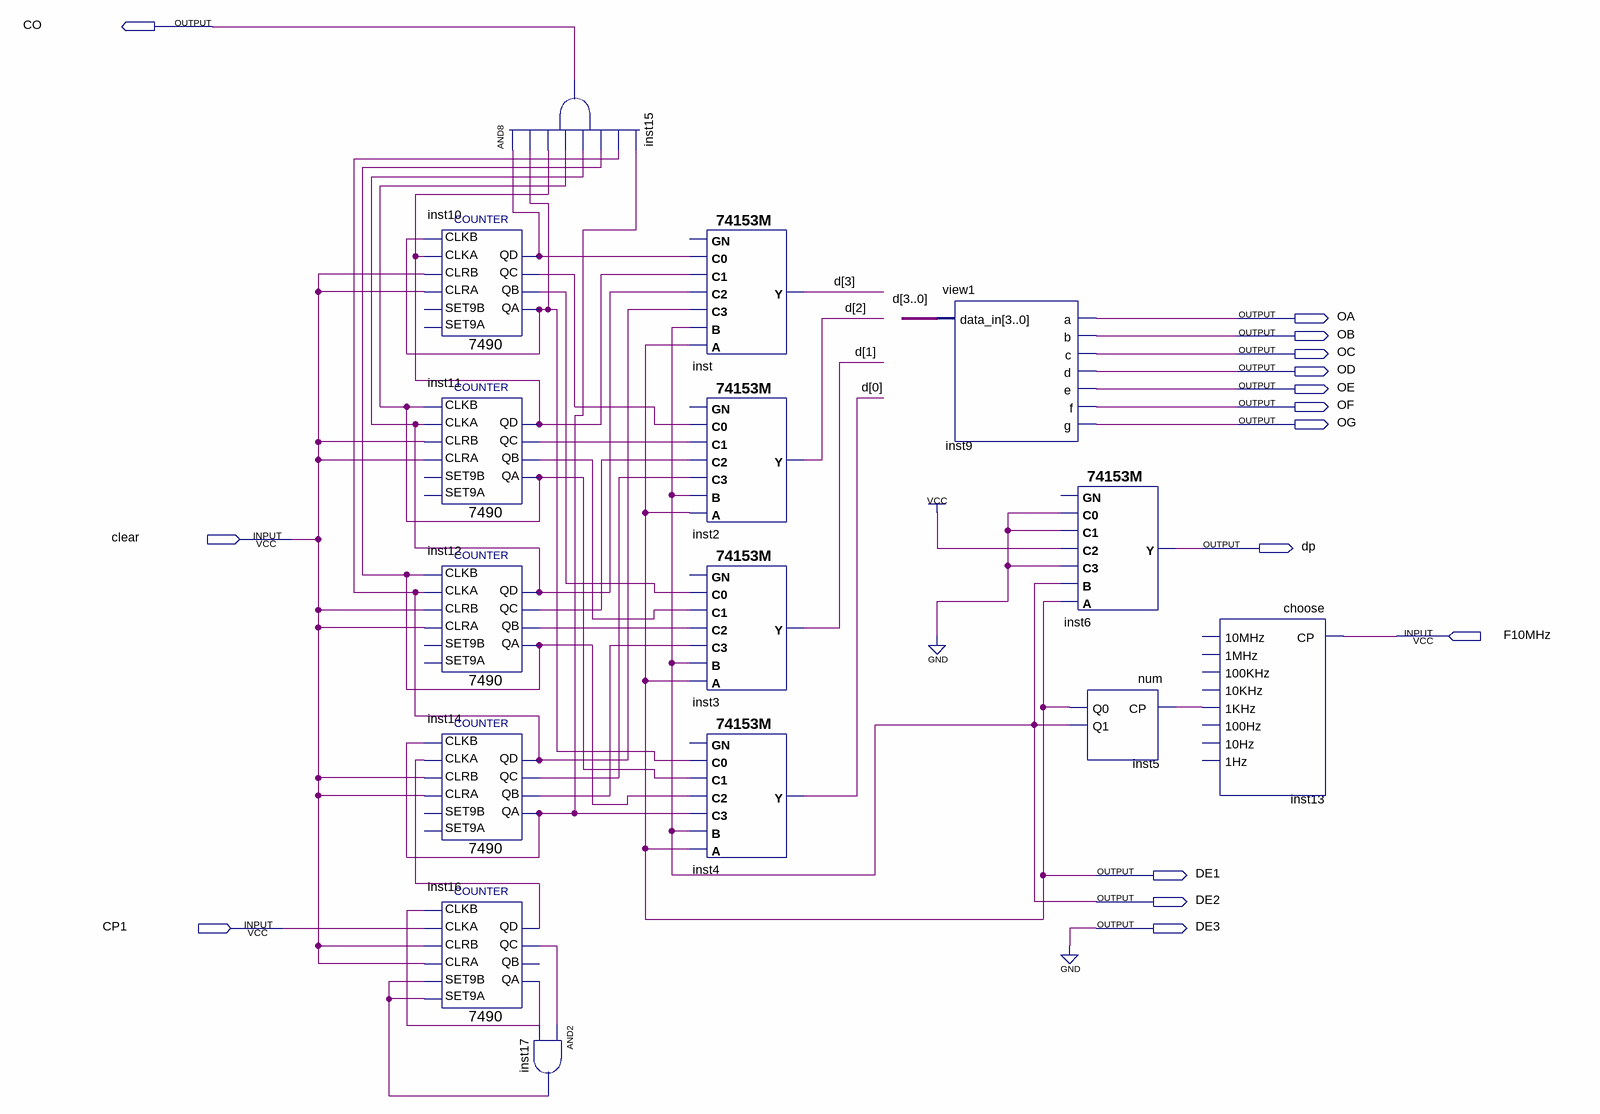
[diagram p0: schematic sheet]
// Quartus schematic viewnew1.bdf as structural Verilog: 15 symbols, 15 pins
module viewnew1 (
  input  clear,
  input  F10MHz,
  input  CP1,
  output CO,
  output OA,
  output OB,
  output OC,
  output OD,
  output OE,
  output OF,
  output OG,
  output dp,
  output DE1,
  output DE2,
  output DE3
);

  wire inst10_qa, inst10_qb, inst10_qc, inst10_qd, inst11_qa, inst11_qb, inst11_qc, inst11_qd, inst12_qa,
       inst12_qb, inst12_qc, inst12_qd, inst13_1khz, inst14_qa, inst14_qb, inst14_qc, inst14_qd, inst16_qa,
       inst16_qc, inst16_qd, inst17_out;
  wire [3:0] d;

  \7490  inst10 (
    .CLRA(clear), .CLKB(inst10_qa), .CLKA(inst11_qd), .CLRB(clear), .QD(inst10_qd), .QA(inst10_qa),
    .QB(inst10_qb), .QC(inst10_qc));  // open: SET9A, SET9B
  \7490  inst11 (
    .CLRA(clear), .CLKB(inst11_qa), .CLKA(inst12_qd), .CLRB(clear), .QD(inst11_qd), .QA(inst11_qa),
    .QB(inst11_qb), .QC(inst11_qc));  // open: SET9A, SET9B
  \7490  inst12 (
    .CLRA(clear), .CLKB(inst12_qa), .CLKA(inst14_qd), .CLRB(clear), .QD(inst12_qd), .QA(inst12_qa),
    .QB(inst12_qb), .QC(inst12_qc));  // open: SET9A, SET9B
  \7490  inst14 (
    .CLRA(clear), .CLKB(inst14_qa), .CLKA(inst16_qd), .CLRB(clear), .QD(inst14_qd), .QA(inst14_qa),
    .QB(inst14_qb), .QC(inst14_qc));  // open: SET9A, SET9B
  \7490  inst16 (
    .SET9A(inst17_out), .CLRA(clear), .SET9B(inst17_out), .CLKB(inst16_qa), .CLKA(CP1), .CLRB(clear),
    .QD(inst16_qd), .QA(inst16_qa), .QC(inst16_qc));  // open: QB
  and inst15 (CO, inst10_qd, inst10_qa, inst11_qd, inst11_qa, inst12_qd, inst12_qa, inst14_qd, inst14_qa);
  and inst17 (inst17_out, inst16_qc, inst16_qa);
  \74153M  inst (
    .A(DE1), .B(DE2), .C3(inst14_qd), .C2(inst12_qd), .C1(inst11_qd), .C0(inst10_qd), .Y(d[3]));  // open: GN
  \74153M  inst2 (
    .A(DE1), .B(DE2), .C3(inst14_qc), .C2(inst12_qc), .C1(inst11_qc), .C0(inst10_qc), .Y(d[2]));  // open: GN
  \74153M  inst3 (
    .A(DE1), .B(DE2), .C3(inst14_qb), .C2(inst12_qb), .C1(inst11_qb), .C0(inst10_qb), .Y(d[1]));  // open: GN
  \74153M  inst4 (
    .A(DE1), .B(DE2), .C3(inst14_qa), .C2(inst12_qa), .C1(inst11_qa), .C0(inst10_qa), .Y(d[0]));  // open: GN
  view1 inst9 (.data_in(d), .a(OA), .b(OB), .c(OC), .d(OD), .e(OE), .f(OF), .g(OG));
  \74153M  inst6 (.A(DE1), .B(DE2), .C3(1'b0), .C2(1'b1), .C1(1'b0), .C0(1'b0), .Y(dp));  // open: GN
  num inst5 (.CP(inst13_1khz), .Q0(DE1), .Q1(DE2));
  choose inst13 (.CP(F10MHz), .\1KHz (inst13_1khz));  // open: 10MHz, 1MHz, 100KHz, 10KHz, 100Hz, 10Hz, 1Hz

  assign DE3 = 1'b0;
endmodule
